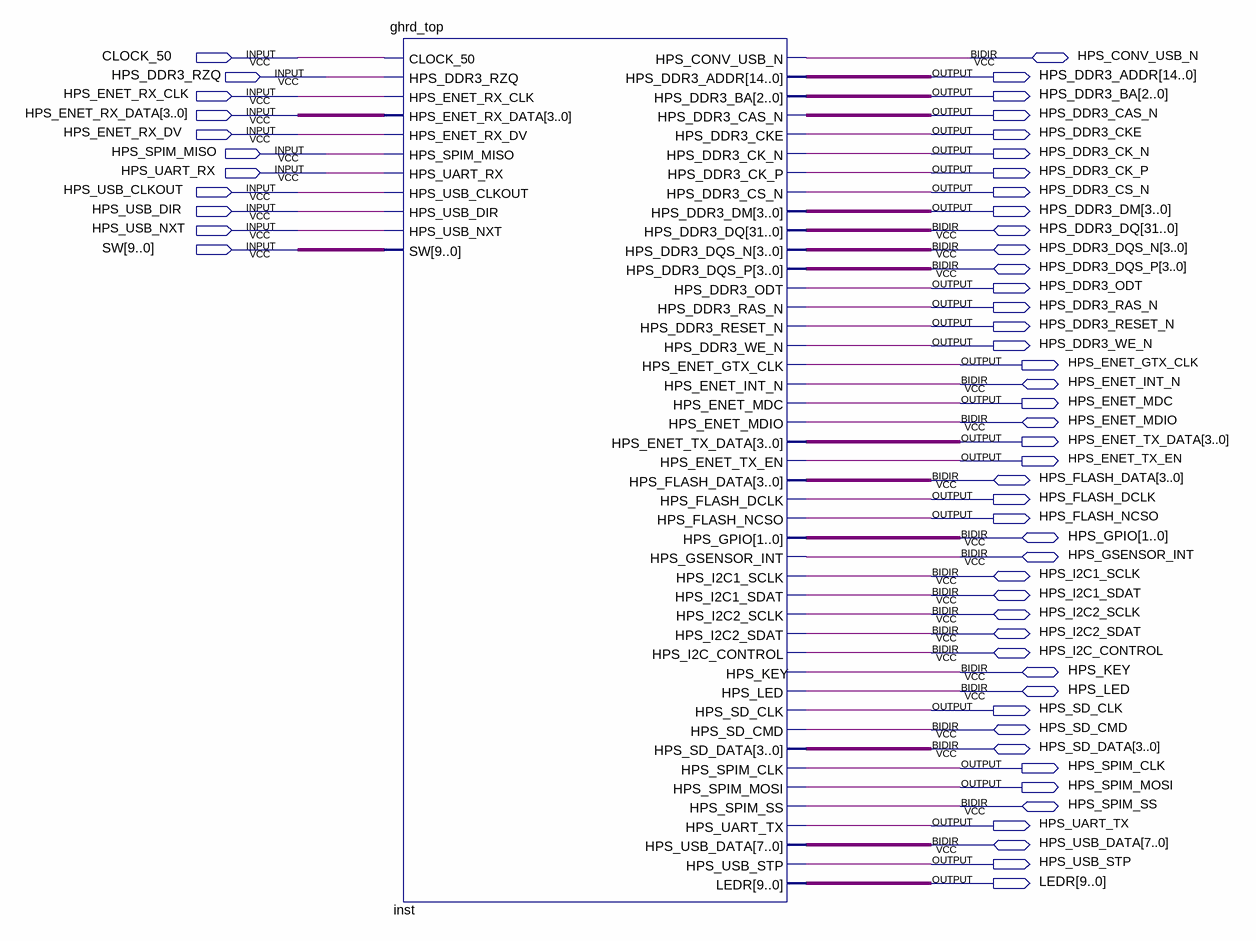
[diagram p0: schematic sheet]
// Quartus schematic HPS_TMP.bdf as structural Verilog: 1 symbols, 55 pins
module HPS_TMP (
  input  CLOCK_50,
  input  HPS_DDR3_RZQ,
  input  HPS_ENET_RX_CLK,
  input  [3:0] HPS_ENET_RX_DATA,
  input  HPS_ENET_RX_DV,
  input  HPS_SPIM_MISO,
  input  HPS_UART_RX,
  input  HPS_USB_CLKOUT,
  input  HPS_USB_DIR,
  input  HPS_USB_NXT,
  input  [9:0] SW,
  inout  HPS_CONV_USB_N,
  inout  [31:0] HPS_DDR3_DQ,
  inout  [3:0] HPS_DDR3_DQS_N,
  inout  [3:0] HPS_DDR3_DQS_P,
  inout  HPS_ENET_INT_N,
  inout  HPS_ENET_MDIO,
  inout  [3:0] HPS_FLASH_DATA,
  inout  [1:0] HPS_GPIO,
  inout  HPS_GSENSOR_INT,
  inout  HPS_I2C1_SCLK,
  inout  HPS_I2C1_SDAT,
  inout  HPS_I2C2_SCLK,
  inout  HPS_I2C2_SDAT,
  inout  HPS_I2C_CONTROL,
  inout  HPS_KEY,
  inout  HPS_LED,
  inout  HPS_SD_CMD,
  inout  [3:0] HPS_SD_DATA,
  inout  HPS_SPIM_SS,
  inout  [7:0] HPS_USB_DATA,
  output [14:0] HPS_DDR3_ADDR,
  output [2:0] HPS_DDR3_BA,
  output HPS_DDR3_CAS_N,
  output HPS_DDR3_CKE,
  output HPS_DDR3_CK_N,
  output HPS_DDR3_CK_P,
  output HPS_DDR3_CS_N,
  output [3:0] HPS_DDR3_DM,
  output HPS_DDR3_ODT,
  output HPS_DDR3_RAS_N,
  output HPS_DDR3_RESET_N,
  output HPS_DDR3_WE_N,
  output HPS_ENET_GTX_CLK,
  output HPS_ENET_MDC,
  output [3:0] HPS_ENET_TX_DATA,
  output HPS_ENET_TX_EN,
  output HPS_FLASH_DCLK,
  output HPS_FLASH_NCSO,
  output HPS_SD_CLK,
  output HPS_SPIM_CLK,
  output HPS_SPIM_MOSI,
  output HPS_UART_TX,
  output HPS_USB_STP,
  output [9:0] LEDR
);

  ghrd_top inst (
    .CLOCK_50(CLOCK_50), .HPS_DDR3_RZQ(HPS_DDR3_RZQ), .HPS_ENET_RX_CLK(HPS_ENET_RX_CLK),
    .HPS_ENET_RX_DATA(HPS_ENET_RX_DATA), .HPS_ENET_RX_DV(HPS_ENET_RX_DV), .HPS_SPIM_MISO(HPS_SPIM_MISO),
    .HPS_UART_RX(HPS_UART_RX), .HPS_USB_CLKOUT(HPS_USB_CLKOUT), .HPS_USB_DIR(HPS_USB_DIR),
    .HPS_USB_NXT(HPS_USB_NXT), .SW(SW), .HPS_DDR3_ADDR(HPS_DDR3_ADDR), .HPS_DDR3_BA(HPS_DDR3_BA),
    .HPS_DDR3_CAS_N(HPS_DDR3_CAS_N), .HPS_DDR3_CKE(HPS_DDR3_CKE), .HPS_DDR3_CK_N(HPS_DDR3_CK_N),
    .HPS_DDR3_CK_P(HPS_DDR3_CK_P), .HPS_DDR3_CS_N(HPS_DDR3_CS_N), .HPS_DDR3_DM(HPS_DDR3_DM),
    .HPS_DDR3_ODT(HPS_DDR3_ODT), .HPS_DDR3_RAS_N(HPS_DDR3_RAS_N), .HPS_DDR3_RESET_N(HPS_DDR3_RESET_N),
    .HPS_DDR3_WE_N(HPS_DDR3_WE_N), .HPS_ENET_GTX_CLK(HPS_ENET_GTX_CLK), .HPS_ENET_MDC(HPS_ENET_MDC),
    .HPS_ENET_TX_DATA(HPS_ENET_TX_DATA), .HPS_ENET_TX_EN(HPS_ENET_TX_EN), .HPS_FLASH_DCLK(HPS_FLASH_DCLK),
    .HPS_FLASH_NCSO(HPS_FLASH_NCSO), .HPS_SD_CLK(HPS_SD_CLK), .HPS_SPIM_CLK(HPS_SPIM_CLK),
    .HPS_SPIM_MOSI(HPS_SPIM_MOSI), .HPS_UART_TX(HPS_UART_TX), .HPS_USB_STP(HPS_USB_STP), .LEDR(LEDR),
    .HPS_CONV_USB_N(HPS_CONV_USB_N), .HPS_DDR3_DQ(HPS_DDR3_DQ), .HPS_DDR3_DQS_N(HPS_DDR3_DQS_N),
    .HPS_DDR3_DQS_P(HPS_DDR3_DQS_P), .HPS_ENET_INT_N(HPS_ENET_INT_N), .HPS_ENET_MDIO(HPS_ENET_MDIO),
    .HPS_FLASH_DATA(HPS_FLASH_DATA), .HPS_GPIO(HPS_GPIO), .HPS_GSENSOR_INT(HPS_GSENSOR_INT),
    .HPS_I2C1_SCLK(HPS_I2C1_SCLK), .HPS_I2C1_SDAT(HPS_I2C1_SDAT), .HPS_I2C2_SCLK(HPS_I2C2_SCLK),
    .HPS_I2C2_SDAT(HPS_I2C2_SDAT), .HPS_I2C_CONTROL(HPS_I2C_CONTROL), .HPS_KEY(HPS_KEY), .HPS_LED(HPS_LED),
    .HPS_SD_CMD(HPS_SD_CMD), .HPS_SD_DATA(HPS_SD_DATA), .HPS_SPIM_SS(HPS_SPIM_SS), .HPS_USB_DATA(HPS_USB_DATA));
endmodule
